# EAGLE design Dual VCA large - Rev3 (EAGLE 9.6.2)
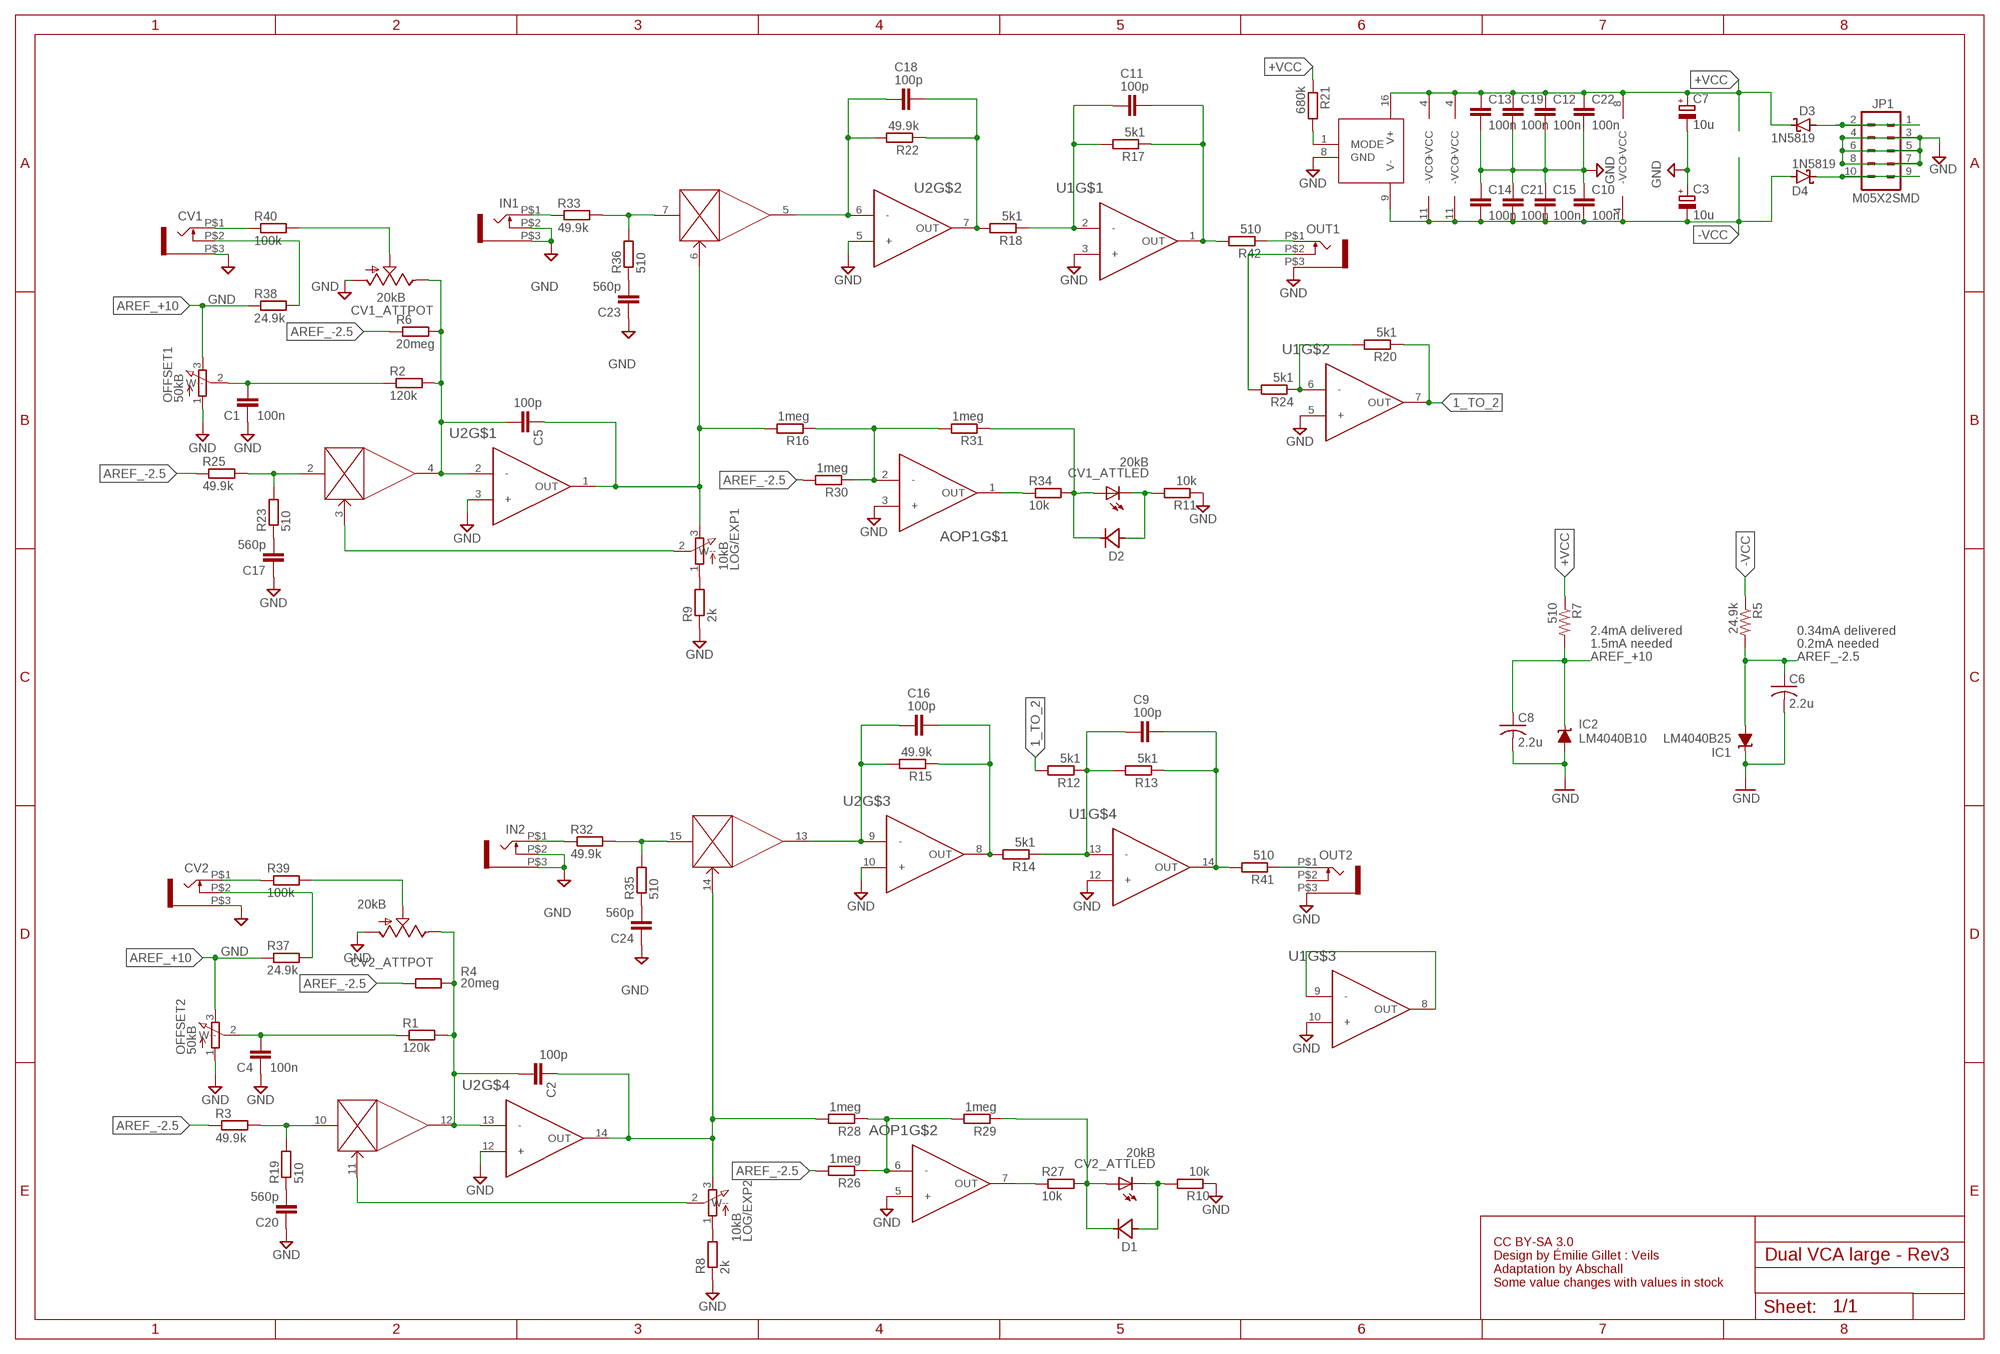
[diagram p0: schematic, sheet 1]

## Parts
AOP1  TL072ACDR  [SOIC8]
C1  100n  C-EUC0805K  [C0805K]
C2  100p  C-EUC0805K  [C0805K]
C3  10u  CPOL-EUB  [PANASONIC_B]
C4  100n  C-EUC0805K  [C0805K]
C5  100p  C-EUC0805K  [C0805K]
C6  2.2u  C-USC0805  [C0805]
C7  10u  CPOL-EUB  [PANASONIC_B]
C8  2.2u  C-USC0805  [C0805]
C9  100p  C-EUC0805K  [C0805K]
C10  100n  C-EUC0805K  [C0805K]
C11  100p  C-EUC0805K  [C0805K]
C12  100n  C-EUC0805K  [C0805K]
C13  100n  C-EUC0805K  [C0805K]
C14  100n  C-EUC0805K  [C0805K]
C15  100n  C-EUC0805K  [C0805K]
C16  100p  C-EUC0805K  [C0805K]
C17  560p  C-EUC0805K  [C0805K]
C18  100p  C-EUC0805K  [C0805K]
C19  100n  C-EUC0805K  [C0805K]
C20  560p  C-EUC0805K  [C0805K]
C21  100n  C-EUC0805K  [C0805K]
C22  100n  C-EUC0805K  [C0805K]
C23  560p  C-EUC0805K  [C0805K]
C24  560p  C-EUC0805K  [C0805K]
CV1  WQP-PJ301M-12_JACK  [WQP-PJ301M-12_JACK]
CV1_ATT  20kB  BOURNS_SLIDER  [BOURNS_SLIDER]
CV2  WQP-PJ301M-12_JACK  [WQP-PJ301M-12_JACK]
CV2_ATT  20kB  BOURNS_SLIDER  [BOURNS_SLIDER]
D1  1N4148WX  [SOD323-W]
D2  1N4148WX  [SOD323-W]
D3  1N5819  [SOD123]
D4  1N5819  [SOD123]
IC1  LM4040B25  LM4041B12DBZ  [DBZ_R-PDSO-G3]
IC2  LM4040B10  LM4041B12DBZ  [DBZ_R-PDSO-G3]
IN1  WQP-PJ301M-12_JACK  [WQP-PJ301M-12_JACK]
IN2  WQP-PJ301M-12_JACK  [WQP-PJ301M-12_JACK]
JP1  M05X2SMD  [2X5-SMD]
LOG/EXP1  10kB  ALPHA9MMSMALL_HOLE  [ALPHA9MM-SH]
LOG/EXP2  10kB  ALPHA9MMSMALL_HOLE  [ALPHA9MM-SH]
OFFSET1  50kB  ALPHA9MMSMALL_HOLE  [ALPHA9MM-SH]
OFFSET2  50kB  ALPHA9MMSMALL_HOLE  [ALPHA9MM-SH]
OUT1  WQP-PJ301M-12_JACK  [WQP-PJ301M-12_JACK]
OUT2  WQP-PJ301M-12_JACK  [WQP-PJ301M-12_JACK]
R1  120k  R-EU_R0805  [R0805]
R2  120k  R-EU_R0805  [R0805]
R3  49.9k  R-EU_R0805  [R0805]
R4  20meg  R-EU_R0805  [R0805]
R5  24.9k  R-US_R0805  [R0805]
R6  20meg  R-EU_R0805  [R0805]
R7  510  R-US_R0805  [R0805]
R8  2k  R-EU_R0805  [R0805]
R9  2k  R-EU_R0805  [R0805]
R10  10k  R-EU_R0805  [R0805]
R11  10k  R-EU_R0805  [R0805]
R12  5k1  R-EU_R0805  [R0805]
R13  5k1  R-EU_R0805  [R0805]
R14  5k1  R-EU_R0805  [R0805]
R15  49.9k  R-EU_R0805  [R0805]
R16  1meg  R-EU_R0805  [R0805]
R17  5k1  R-EU_R0805  [R0805]
R18  5k1  R-EU_R0805  [R0805]
R19  510  R-EU_R0805  [R0805]
R20  5k1  R-EU_R0805  [R0805]
R21  680k  R-EU_R0805  [R0805]
R22  49.9k  R-EU_R0805  [R0805]
R23  510  R-EU_R0805  [R0805]
R24  5k1  R-EU_R0805  [R0805]
R25  49.9k  R-EU_R0805  [R0805]
R26  1meg  R-EU_R0805  [R0805]
R27  10k  R-EU_R0805  [R0805]
R28  1meg  R-EU_R0805  [R0805]
R29  1meg  R-EU_R0805  [R0805]
R30  1meg  R-EU_R0805  [R0805]
R31  1meg  R-EU_R0805  [R0805]
R32  49.9k  R-EU_R0805  [R0805]
R33  49.9k  R-EU_R0805  [R0805]
R34  10k  R-EU_R0805  [R0805]
R35  510  R-EU_R0805  [R0805]
R36  510  R-EU_R0805  [R0805]
R37  24.9k  R-EU_R0805  [R0805]
R38  24.9k  R-EU_R0805  [R0805]
R39  100k  R-EU_R0805  [R0805]
R40  100k  R-EU_R0805  [R0805]
R41  510  R-EU_R0805  [R0805]
R42  510  R-EU_R0805  [R0805]
U1  TL74CD  [SO14]
U2  TL74CD  [SO14]
VCA1  V2164SOIC16N  [SOIC16N]

## Nets
1_TO_2: R12.2 R20.1 U1.7(OUT)
+VCC: AOP1.8(+VCC) C7.+ C12.1 C13.1 C19.1 C22.1 D3.C R7.1 R21.1 U1.4(+VCC) U2.4(+VCC) VCA1.16(V+)
-VCC: AOP1.4(-VCC) C3.- C10.2 C14.2 C15.2 C21.2 D4.A R5.1 U1.11(-VCC) U2.11(-VCC) VCA1.9(V-)
AREF_+10: C8.1 IC2.1(C) OFFSET1.3 OFFSET2.3 R7.2 R37.1 R38.1
AREF_-2.5: C6.1 IC1.2(A) R3.1 R4.1 R5.2 R6.1 R25.1 R26.2 R30.2
GND: AOP1.3(+) AOP1.5(+) C1.1 C3.+ C4.1 C6.2 C7.- C8.2 C10.1 C12.2 C13.2 C14.1 C15.1 C17.1 C19.2 C20.1 C21.1 C22.2 C23.1 C24.1 CV1.P$3 CV1_ATT.1(POT:A) CV2.P$3 CV2_ATT.1(POT:A) IC1.1(C) IC2.2(A) IN1.P$2 IN1.P$3 IN2.P$2 IN2.P$3 JP1.3 JP1.4 JP1.5 JP1.6 JP1.7 JP1.8 OFFSET1.1 OFFSET2.1 OUT1.P$3 OUT2.P$3 R8.1 R9.1 R10.1 R11.1 U1.3(+) U1.5(+) U1.10(+) U1.12(+) U2.3(+) U2.5(+) U2.10(+) U2.12(+) VCA1.8(GND)
N$1: C23.2 R36.1
N$2: CV2.P$1 R39.1
N$3: R33.2 R36.2 VCA1.7(IN)
N$4: C18.2 R22.2 U2.6(-) VCA1.5(OUT)
N$5: C5.2 CV1_ATT.3(POT:E) R2.2 R6.2 U2.2(-) VCA1.4(OUT)
N$6: IN2.P$1 R32.1
N$7: R21.2 VCA1.1(MODE)
N$8: C1.2 OFFSET1.2(W--) R2.1
N$9: C5.1 LOG/EXP1.3 R16.2 U2.1(OUT) VCA1.6(CV)
N$10: C17.2 R23.1
N$11: LOG/EXP1.1 R9.2
N$12: R23.2 R25.2 VCA1.2(IN)
N$13: LOG/EXP1.2(W--) VCA1.3(CV)
N$14: CV1_ATT.2(POT:S) R40.2
N$15: C11.2 R17.2 R18.1 U1.2(-)
N$16: R20.2 R24.1 U1.6(-)
N$17: CV1_ATT.E(LED:C) D2.A R11.2
N$18: CV2_ATT.B(LED:A) D1.C R27.2 R29.1
N$19: IN1.P$1 R33.1
N$20: CV1.P$2 R38.2
N$21: OUT1.P$1 R42.1
N$22: OUT1.P$2 R24.2
N$23: C24.2 R35.1
N$24: R32.2 R35.2 VCA1.15(IN)
N$25: C16.2 R15.2 U2.9(-) VCA1.13(OUT)
N$26: C2.1 LOG/EXP2.3 R28.2 U2.14(OUT) VCA1.14(CV)
N$27: C20.2 R19.1
N$28: R3.2 R19.2 VCA1.10(IN)
N$29: LOG/EXP2.1 R8.2
N$30: LOG/EXP2.2(W--) VCA1.11(CV)
N$31: C2.2 CV2_ATT.3(POT:E) R1.2 R4.2 U2.13(-) VCA1.12(OUT)
N$32: C4.2 OFFSET2.2(W--) R1.1
N$33: CV2_ATT.2(POT:S) R39.2
N$34: C9.2 R12.1 R13.2 R14.1 U1.13(-)
N$35: U1.8(OUT) U1.9(-)
N$37: CV1_ATT.B(LED:A) D2.C R31.1 R34.2
N$38: CV1.P$1 R40.1
N$40: CV2.P$2 R37.2
N$41: OUT2.P$1 R41.1
N$42: D4.C JP1.9 JP1.10
N$43: AOP1.1(OUT) R34.1
N$44: AOP1.2(-) R16.1 R30.1 R31.2
N$46: CV2_ATT.E(LED:C) D1.A R10.2
N$48: AOP1.7(OUT) R27.1
N$49: AOP1.6(-) R26.1 R28.1 R29.2
N$51: D3.A JP1.1 JP1.2
OUT: C18.1 R18.2 R22.1 U2.7(OUT)
OUT1: C11.1 R17.1 R42.2 U1.1(OUT)
OUT2: C16.1 R14.2 R15.1 U2.8(OUT)
OUT3: C9.1 R13.1 R41.2 U1.14(OUT)
Unconnected: OUT2.P$2

## Notes on the sheet
- 2.4mA delivered | 0.34mA delivered
- 1.5mA needed | 0.2mA needed
- CC BY-SA 3.0
  Design by Émilie Gillet : Veils 
  Adaptation by Abschall
  Some value changes with values in stock

## Library data of the parts
AOP1 = personal devices:TL072ACDR
C1 C2 C4 C5 C9-C24 = resistor:C-EU: CAPACITOR, European symbol
C3 C7 = rcl:CPOL-EU: POLARIZED CAPACITOR, European symbol; SPICEPREFIX: C
C6 C8 = rcl:C-US: CAPACITOR, American symbol
CV1 CV2 IN1 IN2 OUT1 OUT2 = thonkiconn:WQP-PJ301M-12_JACK
CV1_ATT CV2_ATT = og-pots:BOURNS_SLIDER
D1 D2 = personal devices:1N4148WX
D3 D4 = personal-ICs:1N5819
IC1 IC2 = texas:LM4041: PRECISION MICROPOWER SHUNT VOLTAGE REFERENCE Source: http://focus.ti.com/lit/ds/slcs146e/slcs146e.pdf
JP1 = og-header:M05X2: Header 5x2 Standard 10-pin dual row 0.1" header. Commonly used with AVR-ISP. Use with Spark Fun Electronics SKU: PRT-00778
LOG/EXP1 LOG/EXP2 OFFSET1 OFFSET2 = potentiometer:ALPHA9MM
R1-R4 R6 R8-R35 R37-R42 = resistor:R-EU_: RESISTOR, European symbol
R5 R7 = rcl:R-US_: RESISTOR, American symbol
R36 = rcl:R-EU_: RESISTOR, European symbol; SPICEPREFIX: R
U1 U2 = personal-ICs:TL74CD
VCA1 = personal-ICs:V2164

## Board
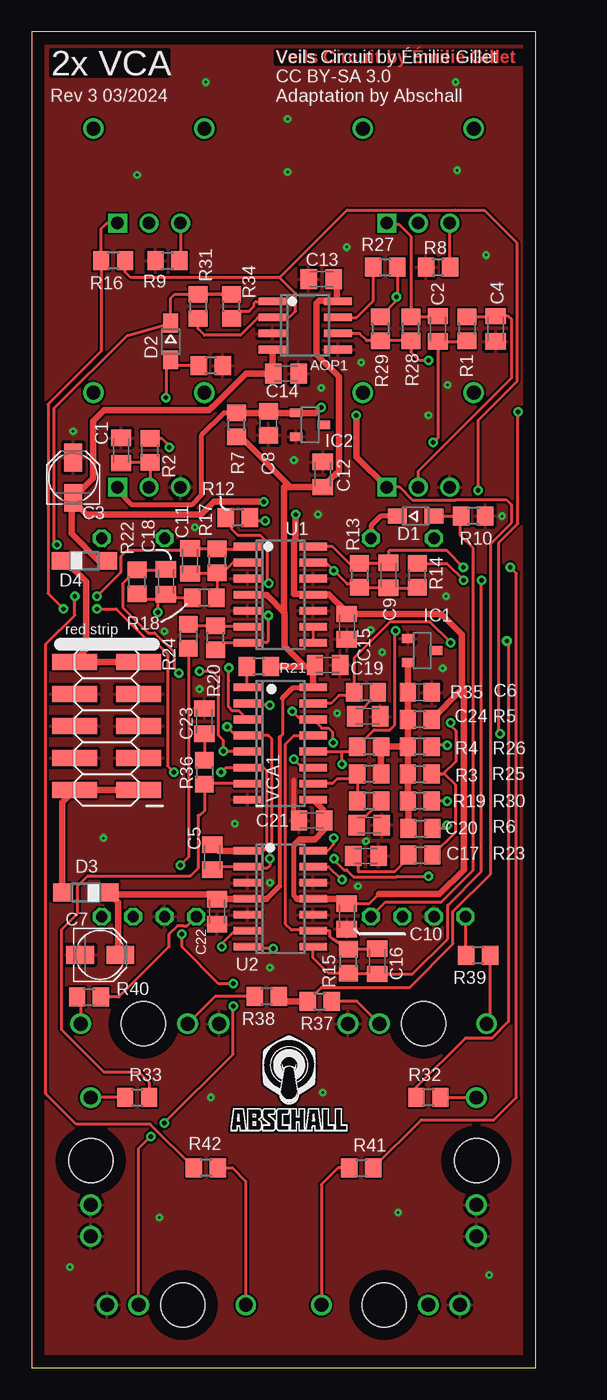
[diagram p1: board, top side]
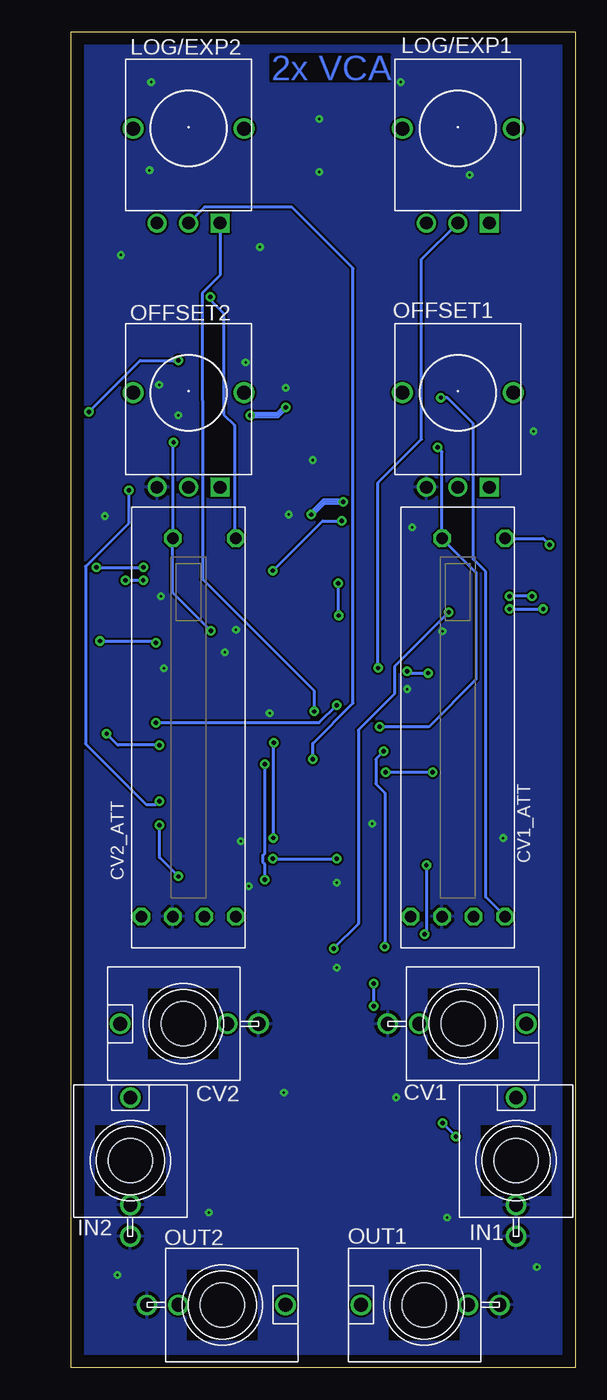
[diagram p2: board, bottom side, seen from below]

Size 40 x 106 mm. Coordinates in mm from the lower left corner, seen from the top.
Outline: 0,0 40,0 40,106 0,106 0,0
Copper layers (1*16): Top 0.035mm / dielectric 1.5mm / Bottom 0.035mm
Design rules "default": minimum track width 6mil, minimum drill 0.35mm, track to track 6mil, track to pad 6mil, pad to pad 6mil, via to via 6mil, smd to smd 6mil, copper to edge 40mil, drill to drill 6mil, minimum pad ring 10mil, minimum via ring 8mil, stop-mask expansion 4mil, vias tented up to drill 0mil, thermal gap 10mil

### Footprints (pad centres in the part's own frame; a part is rotated, then mirrored left to right if it is on the bottom)
SOIC8 = smd 0.6 x 2.2: 1 -1.905,-2.6; 2 -0.635,-2.6; 3 0.635,-2.6; 4 1.905,-2.6; 5 1.905,2.6; 6 0.635,2.6; 7 -0.635,2.6; 8 -1.905,2.6
C0805K = smd 1.3 x 1.6: 1 -1,0; 2 1,0
PANASONIC_B = smd 2.2 x 1.4: + 1.6,0; - -1.6,0
C0805 = smd 1.3 x 1.5: 1 -0.95,0; 2 0.95,0
WQP-PJ301M-12_JACK = drill 1.1: P$1 0,5; P$2 0,-3.5; P$3 0,-5.992 | hole 3.5: 0,0
BOURNS_SLIDER = drill 0.9 octagon: 1 -15,1.25; 2 -15,3.75; 3 15,1.25; B 15,-3.75; DUMMY -15,-1.25; E -15,-3.75
SOD323-W = smd 1.5 x 1.2: A 1.45,0; C -1.45,0
SOD123 = smd 1.4 x 1.4: A 1.9,0; C -1.9,0
DBZ_R-PDSO-G3 = smd 0.7 x 1: 1 -0.95,-1.1; 2 0.95,-1.1; 3 0,1.1
2X5-SMD = smd 3.556 x 1.27: 1 -2.54,5.08; 2 2.54,5.08; 3 -2.54,2.54; 4 2.54,2.54; 5 -2.54,0; 6 2.54,0; 7 -2.54,-2.54; 8 2.54,-2.54; 9 -2.54,-5.08; 10 2.54,-5.08
ALPHA9MM-SH = drill 1: 1 -2.5,0; 2 0,0 | drill 1 square: 3 2.5,0 | drill 1.1: NC1 -4.4,7.5; NC2 4.4,7.5
R0805 = smd 1.3 x 1.5: 1 -0.95,0; 2 0.95,0
SO14 = smd 0.6 x 2.2: 1 -3.81,-2.6; 2 -2.54,-2.6; 3 -1.27,-2.6; 4 0,-2.6; 5 1.27,-2.6; 6 2.54,-2.6; 7 3.81,-2.6; 8 3.81,2.6; 9 2.54,2.6; 10 1.27,2.6; 11 0,2.6; 12 -1.27,2.6; 13 -2.54,2.6; 14 -3.81,2.6
SOIC16N = smd 0.6 x 2.2: 1 -4.445,-2.6; 2 -3.175,-2.6; 3 -1.905,-2.6; 4 -0.635,-2.6; 5 0.635,-2.6; 6 1.905,-2.6; 7 3.175,-2.6; 8 4.445,-2.6; 9 4.445,2.6; 10 3.175,2.6; 11 1.905,2.6; 12 0.635,2.6; 13 -0.635,2.6; 14 -1.905,2.6; 15 -3.175,2.6; 16 -4.445,2.6

### Placement (x,y rotation side)
AOP1  21.72,82.68 270 top
C1  7.11,72.77 270 top
C2  32.26,82.42 270 top
C3  3.3,70.61 90 top
C4  36.83,82.42 90 top
C5  14.35,40.51 270 top
C6  30.81,53.59 0 top
C7  5.46,32.77 0 top
C8  18.8,74.93 270 top
C9  28.32,62.87 270 top
C10  25.02,35.81 90 top
C11  12.57,64.01 270 top
C12  23.11,70.87 90 top
C13  22.99,86.36 180 top
C14  20.19,78.87 180 top
C15  25.02,58.8 90 top
C16  27.43,32.26 90 top
C17  26.54,40.6 180 top
C18  10.67,62.36 90 top
C19  23.5,55.75 0 top
C20  26.8,43.05 180 top
C21  22.23,43.43 0 top
C22  14.73,36.2 270 top
C23  13.72,51.31 270 top
C24  26.67,51.69 180 top
CV1  8.89,27.3 270 bottom
CV1_ATT  9.32,50.8 90 bottom
CV2  31.11,27.3 90 bottom
CV2_ATT  30.69,50.8 90 bottom
D1  30.48,67.56 0 top
D2  11.05,81.41 270 top
D3  4.32,37.72 180 top
D4  4.19,64.01 0 top
IC1  30.99,56.9 270 top
IC2  22.1,74.8 270 top
IN1  4.7,16.45 0 bottom
IN2  35.31,16.45 0 bottom
JP1  5.97,50.93 180 top
LOG/EXP1  9.32,90.81 0 bottom
LOG/EXP2  30.69,90.81 0 bottom
OFFSET1  9.32,69.85 0 bottom
OFFSET2  30.69,69.85 0 bottom
OUT1  12,5 90 bottom
OUT2  28,5 270 bottom
R1  34.54,82.42 270 top
R2  9.4,72.77 90 top
R3  26.8,47.12 180 top
R4  26.8,49.28 180 top
R5  30.81,51.44 180 top
R6  30.86,42.8 0 top
R7  16.26,74.8 90 top
R8  32.26,87.31 0 top
R9  10.79,87.82 0 top
R10  35.05,67.56 180 top
R11  14.22,79.5 180 top
R12  16.38,67.44 180 top
R13  26.04,62.87 270 top
R14  30.61,62.87 90 top
R15  25.15,32.26 90 top
R16  6.48,87.82 180 top
R17  14.73,64.01 270 top
R18  13.72,61.09 180 top
R19  26.8,44.96 180 top
R20  14.61,57.91 90 top
R21  18.03,55.63 180 top
R22  8.38,62.36 90 top
R23  30.86,40.68 0 top
R24  12.45,58.04 270 top
R25  30.81,47.12 0 top
R26  30.81,49.28 180 top
R27  28.07,87.31 0 top
R28  30.1,82.42 90 top
R29  27.69,82.42 270 top
R30  30.81,44.96 180 top
R31  13.21,84.2 270 top
R32  31.5,21.46 180 top
R33  8.38,21.46 0 top
R34  15.88,84.2 90 top
R35  26.54,53.59 180 top
R36  13.72,47.24 270 top
R37  22.86,29.08 0 top
R38  18.67,29.46 180 top
R39  35.43,32.73 180 top
R40  4.57,29.42 0 top
R41  26.16,15.88 0 top
R42  13.84,15.88 180 top
U1  19.75,61.34 270 top
U2  19.75,37.21 270 top
VCA1  19.75,49.53 270 top

### Tracks (layer width: path | path; a pad name or v marks a point on that pad's centre or on a via)
1_TO_2  (via drill 0.35)
  Top 0.254: R20.1 15.17,57.53 U1.7 18.67,57.53 18.79,57.65 v18.79,59.68 | R12.2 15.88,67.44 15.88,66.55 16.38,66.04 18.16,66.04 18.69,65.51 18.69,62.38 v18.82,62.25
  Bottom 0.254: v18.79,59.68 18.82,59.71 v18.82,62.25
+VCC
  Top 0.254: 19.9,53.12 19.9,50.26 19.68,50.04
  Top 0.305: 19.68,50.04 19.68,38.23
  Top 0.406: 22.29,53.92 20.7,53.92 19.9,53.12 | 19.68,38.23 18.67,37.21
  Top 0.508: C7.+ 6.86,32.97 6.86,36.94 6.22,37.58 6.36,37.58 | U1.4 17.2,61.28 18.67,61.28 20.05,59.91 | 20.05,59.91 20.07,59.89 20.07,57.28 21.72,55.63 | 21.72,55.63 22.37,55.63 C19.1 22.35,55.61 VCA1.16 22.29,53.92 | R7.1 16.57,73.85 20.56,69.87 | 20.56,69.87 C12.1 24.06,70.81 24.08,70.81 24.38,71.11 24.38,78.61 22.61,80.39 22.61,84.45 22.81,84.66 24.24,84.66 | 20.56,69.87 20.05,69.87 20.05,59.91 | C13.1 24.24,86.11 24.24,84.66 | 24.24,84.66 AOP1.8 | 21.72,55.63 R21.1 | 18.67,37.21 U2.4 14.75,37.21 C22.1 14.35,37.58 7.11,37.58 6.36,37.58 | D3.C 6.36,37.58
-VCC  (via drill 0.35)
  Top 0.254: 25.27,37.21 25.27,37.07 C10.2 25.04,36.83 26.8,36.83 27.56,37.59
  Top 0.406: 21.08,37.21 20.83,37.47 20.83,41.48
  Top 0.508: 3.17,68.89 3.17,66.17 5.33,64.01 D4.A | 3.17,68.89 C3.- 4.89,70.6 4.89,75.1 5.78,75.99 14.1,75.99 14.31,76.2 14.35,76.2 17.02,78.87 C14.2 19.12,78.94 AOP1.4 | 21.08,37.21 U2.11 25.27,37.21 | R5.1 34.16,53.83 | 34.16,53.83 34.29,53.96 34.29,39.5 32.38,37.59 27.56,37.59 | 34.16,53.83 34.16,58.17 32.53,59.8 C15.2 25.02,59.94 23.62,61.34 U1.11 22.29,61.4 20.84,61.4 20.84,65.62 20.95,65.73 v20.95,67.69 | v18.41,68.71 14.47,68.71 13.44,67.67 4.39,67.67 3.17,68.89 | 20.83,41.48 21.26,41.91 22.48,41.91 23.23,42.66 C21.2 23.12,43.43 23.12,44.31 VCA1.9
  Bottom 0.508: v20.95,67.69 19.94,68.71 v18.41,68.71
AREF_+10  (via drill 0.35)
  Top 0.254: C8.1 18.67,75.75 | R37.1 23.03,30.2 30.01,30.2 33.45,33.64 33.45,36.21 36.45,39.2 36.45,65.41 38.1,67.06 38.1,68.45 37.72,68.83 33.63,68.83 33.62,68.82 30.26,68.82 29.23,69.85 OFFSET2.3
  Top 0.406: R7.2 15.27,75.75 13.46,73.94 13.46,69.22 12.7,68.45 8,68.45 6.82,69.64 OFFSET1.3 | C8.1 18.73,75.82 18.73,75.75
  Top 0.508: R37.1 20,29.08 R38.1 | R7.2 18.67,75.75 | 18.73,75.75 IC2.1 22.54,75.75 v22.99,76.2 | OFFSET2.3 25.78,72.26 v25.78,75.56
  Bottom 0.508: v25.78,75.56 23.62,75.56 v22.99,76.2
AREF_-2.5
  Top 0.508: R6.1 29.91,44.91 R30.2 R25.1 R26.2 | R26.2 R5.2 C6.1 29.86,55.92 IC1.2 | R26.2 R4.1 R3.1
GND  (via drill 0.2)
  Top 0.406: C21.1 20.83,43.83 20.83,46.61
  other vias: 5.71,42.04 20.32,99.06 33.66,101.98 13.84,101.98 31.5,75.56 13.34,53.85 26.54,41.78 16.13,43.18 10.54,58.42 18.92,31.75 18.92,38.48 20.83,72.01 25.02,88.9 36.07,88.27 27.81,56.77 12.95,66.67 3.3,74.3 26.92,58.55 32.89,61.21 37.34,67.56 33.02,77.98 22.99,77.72 26.16,79.76 22.73,67.69 23.11,21.84 14.22,21.46 36.32,7.37 29.08,12.32 3.05,8 10.16,11.94 20.32,94.87 33.78,95 8.38,94.61 32.64,55.5 24.26,51.94 25.91,38.23
  pour Bottom: 0,105.92 0,0.25 39.75,0.25 39.88,0.13 39.88,105.92
  pour Top: 0,106.05 0,0 40.01,0 40.01,106.05
N$1
  Top 0.254: C23.2 R36.1
N$2
  Top 0.254: R39.1 36.38,27.57 CV2.P$1
N$3
  Top 0.254: R33.2 9.33,22.67 8.51,23.5 5.71,23.5 2.41,26.8 2.41,34.8 3.67,36.06 3.67,38.24 4.46,39.03 12.62,39.03 13.21,39.62 13.21,43.81 13.34,43.81 13.72,44.2 R36.2 13.72,46.35 VCA1.7
N$4  (via drill 0.35)
  Top 0.254: v13.34,55.24 14.35,55.24 14.86,54.74 14.86,50.16 15.22,49.81 v15.22,48.91 17.13,48.91 VCA1.5 | v11.68,55.12 11.3,55.5 11.3,56.77 9.78,58.29 9.27,58.29 7.24,60.33 7.24,62.23 8.32,63.31 R22.2 10.62,63.31 C18.2 | U2.6 16.13,34.67 15.11,33.66 v15.11,33.4
  Bottom 0.254: v13.34,55.24 13.21,55.12 v11.68,55.12 | v15.11,33.4 15.09,33.42 15.09,45.59 15.83,46.33 15.83,48.3 v15.22,48.91
N$5  (via drill 0.35)
  Top 0.254: v10.92,73.03 10.92,73.15 10.35,73.72 R2.2 | C5.2 14.59,39.75 U2.2 17.28,39.62 18.67,39.62 18.92,39.88 v18.92,40.39 18.92,40.95 19.07,41.11 19.07,49.89 18.8,50.16 VCA1.4 16.21,50.16 v15.52,50.86 | v31.5,38.99 29.02,38.99 29,38.96 25.55,38.96 25,39.52 24.78,39.52 24,40.29 v24,40.39 | v33,43.05 32.74,42.8 R6.2
  Bottom 0.254: v10.92,73.03 10.57,72.67 CV1_ATT.3 7.87,63.11 7.87,54.61 11.63,50.86 v15.52,50.86 | v24,40.39 v18.92,40.39 | v31.5,38.99 33,40.49 v33,43.05
N$6
  Top 0.254: R32.1 35.29,21.46 IN2.P$1
N$7
  Top 0.254: VCA1.1 17.08,54.04 R21.2
N$8
  Top 0.254: OFFSET1.2 9.4,69.93 R2.1 7.16,71.82 C1.2
N$9  (via drill 0.35)
  Top 0.254: 16.76,41.02 18.41,41.02 18.67,41.27 18.67,47.37 18.41,47.62 VCA1.6 15.42,47.62 v15.04,47.24 | LOG/EXP1.3 5.97,90.81 5.53,90.36 R16.2 5.53,80.65 1.31,76.44 1.31,61.43 v2.54,60.2 | v5.21,60.2 6.73,60.2 9.14,57.78 9.65,57.78 10.79,56.64 10.79,47.75 v11.3,47.24
  Top 0.508: U2.1 16.76,41.02 14.84,41.02 C5.1
  Bottom 0.254: v5.21,60.2 v2.54,60.2 | v11.3,47.24 v15.04,47.24
N$10
  Top 0.254: C17.2 25.91,40.23 25.91,39.37 28.83,39.37 29.91,40.45 R23.1
N$11
  Top 0.254: LOG/EXP1.1 11.82,87.89 R9.2
N$12  (via drill 0.35)
  Top 0.254: R23.2 33.66,42.52 33.66,46.23 32.77,47.12 R25.2 32.65,47.12 33.66,48.12 33.66,50.55 33.27,50.93 v33.27,51.18 | v18.92,52.58 17.28,52.58 VCA1.2
  Bottom 0.254: v33.27,51.18 20.32,51.18 v18.92,52.58
N$13  (via drill 0.35)
  Top 0.254: VCA1.3 16.46,52.13 15.93,52.13 15.65,52.41 15.65,54.52 15.64,54.53 v15.64,55.52
  Bottom 0.254: v15.64,55.52 15.64,70.21 12.19,73.66 12.19,87.93 LOG/EXP1.2
N$14
  Top 0.254: R40.2 6.92,29.42 10.92,33.43 10.92,34.42 11.58,35.08 12.06,35.08 12.34,35.08 CV1_ATT.2
N$15
  Top 0.254: U1.2 16,63.88 15.18,63.06 R17.2 | C11.2 12.62,63.06 R17.2 | R17.2 14.73,61.15 R18.1
N$16
  Top 0.254: R24.1 12.54,58.9 12.57,58.86 R20.2 17.09,58.86 U1.6
N$17  (via drill 0.35)
  Top 0.254: D2.A 10.88,79.79 | 10.88,79.79 10.67,79.58 v10.67,76.96 | R11.2 11.18,79.5 10.88,79.79
  Bottom 0.254: CV1_ATT.E 7.11,37.34 7.11,63.16 8.11,64.15 8.11,74.91 10.16,76.96 v10.67,76.96
N$18  (via drill 0.35)
  Top 0.254: R27.2 29.02,85.02 v28.96,84.96 28.96,84.64 R29.1
  Top 0.406: D1.C 27.69,67.56 26.94,66.81 CV2_ATT.B
  Bottom 0.254: v28.96,84.96 28.96,84.71 27.9,83.65 27.9,75.62 27.05,74.77 27.05,65.91 CV2_ATT.B
N$19
  Top 0.254: R33.1 4.71,21.46 IN1.P$1
N$20
  Top 0.254: R38.2 14.55,29.46 CV1.P$2
N$21
  Top 0.254: R42.1 15.94,15.88 17,14.81 OUT1.P$1
N$22  (via drill 0.35)
  Top 0.254: OUT1.P$2 8.5,17.41 9.46,18.36 v9.47,18.36 | v16,30.48 14.86,30.48 11.94,33.4 v11.94,34.42 | R24.2 12.45,40.51 v11.81,39.88 | v10.54,19.43 16,24.89 v16,28.7
  Bottom 0.254: v16,30.48 v16,28.7 | v11.81,39.88 v11.8,39.88 11.8,34.55 v11.94,34.42 | v9.47,18.36 v10.54,19.43
N$23
  Top 0.254: R35.1 27.38,53.48 27.47,53.48 C24.2
N$24  (via drill 0.35)
  Top 0.254: VCA1.15 23.75,52.7 24.38,53.34 25.34,53.34 R35.2 25.59,56.33 28.45,59.18 31.62,59.18 v33.27,57.53 | R32.2 30.55,22.29 34.46,26.2 36.57,26.2 37.85,27.47 37.85,57.53 v37.72,57.66
  Bottom 0.254: v37.72,57.66 33.4,57.66 v33.27,57.53
N$25
  Top 0.254: C16.2 27.38,33.21 R15.2 23.88,34.04 23.68,34.23 23.68,34.67 U2.9 22.29,34.73 20.62,34.73 20.17,35.18 20.17,49.51 20.83,50.16 VCA1.13
N$26  (via drill 0.35)
  Top 0.254: C2.1 32.21,83.37 R28.2 30.1,89.78 29.2,90.68 28.31,90.68 LOG/EXP2.3 | v23.93,49.6 23.93,49.73 23.88,49.78 23.88,50.43 23.56,50.74 23.04,50.74 VCA1.14 21.34,51.44 v20.7,52.07 | v23.98,42.04 23.98,41.53 23.47,41.02 U2.14
  Bottom 0.254: v23.93,49.6 23.98,49.55 v23.98,42.04 | LOG/EXP2.3 28.19,86.66 29.61,85.23 29.61,76.76 29.59,76.74 29.59,62.57 20.7,53.68 v20.7,52.07
N$27
  Top 0.254: C20.2 27.67,44.88 R19.1
N$28
  Top 0.254: VCA1.10 23.88,46.35 24.26,46.74 25.47,46.74 R3.2 R19.2
N$29
  Top 0.254: R8.2 33.21,90.78 LOG/EXP2.1
N$30  (via drill 0.35)
  Top 0.254: VCA1.11 21.47,47.62 v20.82,48.27
  Bottom 0.254: v20.82,48.27 20.82,49.53 17.63,52.73 17.63,87.23 22.48,92.08 29.42,92.08 LOG/EXP2.2
N$31  (via drill 0.35)
  Top 0.254: VCA1.12 24.64,48.9 | 24.64,48.9 25.47,48.9 R4.2 27.18,50.61 28.44,50.61 28.83,51 28.83,58.39 v28.91,58.47 | U2.13 23.58,39.75 24.6,38.73 v24.64,38.73 | v24.64,47.88 24.64,48.9 | R1.2 34.49,81.42 C2.2 32.26,73.79 v31.88,73.41
  Bottom 0.254: v24.64,38.73 24.64,39.96 24.79,40.11 24.79,40.66 24.64,40.81 v24.64,47.88 | v28.91,58.47 31.94,61.5 CV2_ATT.3 31.94,73.35 v31.88,73.41
N$32
  Top 0.254: R1.1 36.78,83.37 C4.2 37.85,83.42 38.1,83.17 38.1,78.53 30.69,71.12 OFFSET2.2
N$33
  Top 0.254: R39.2 34.48,35.75 CV2_ATT.2
N$34  (via drill 0.35)
  Top 0.254: U1.13 23.36,63.88 v23.99,63.25 25.07,62.17 25.27,62.17 25.53,61.91 R13.2 28.27,61.91 C9.2 30.56,61.87 R14.1 | v18.54,67.18 17.91,67.18 17.65,67.44 R12.1
  Bottom 0.254: v23.99,63.25 20.05,67.18 v18.54,67.18
N$35
  Top 0.254: U1.9 U1.8
N$37  (via drill 0.35)
  Top 0.254: v2.03,65.28 1.78,65.53 1.78,76.07 7.6,81.89 D2.C 11.05,84.84 11.36,85.15 R34.2 R31.1
  Bottom 0.254: CV1_ATT.B 2.55,65.8 v2.03,65.28
N$38
  Top 0.254: R40.1 3.89,29.16 CV1.P$1
N$40
  Top 0.254: CV2.P$2 25.84,29.08 R37.2
N$41
  Top 0.254: R41.1 24.32,15.88 23,14.55 OUT2.P$1
N$42
  Top 0.508: JP1.9 JP1.10 3.43,56.13 4.32,57.03 4.32,62.36 2.67,64.01 D4.C
N$43
  Top 0.254: R34.1 16.44,83.82 17.27,83.82 17.65,84.2 17.65,84.45 17.78,84.58 AOP1.1
N$44  (via drill 0.35)
  Top 0.254: R16.1 7.43,86.93 7.87,86.49 19.68,86.49 | 19.68,86.49 20.95,85.22 20.95,83.82 20.45,83.31 AOP1.2 17.97,83.31 16.58,81.92 13.72,81.92 13.21,82.42 R31.2 | 19.68,86.49 25.04,91.84 33.62,91.84 33.63,91.82 35.94,91.82 38.51,89.26 38.51,78.23 35.43,75.16 v35.43,69.6 | v33,44.96 R30.1
  Bottom 0.254: v35.43,69.6 35.43,66.99 38.86,63.57 38.86,49.51 34.05,44.7 33.25,44.7 v33,44.96
N$46
  Top 0.254: D1.A 34.04,67.56 | 34.04,67.56 R10.2 | CV2_ATT.E 28.09,36.96 32.51,36.96 35.05,39.5 35.05,65.02 34.04,66.04 34.04,67.56
N$48
  Top 0.254: AOP1.7 25.78,83.31 27.12,84.65 R27.1
N$49  (via drill 0.35)
  Top 0.254: AOP1.6 26.04,82.04 26.6,81.47 R29.2 R28.1 30.1,80.58 30.78,79.91 v31.5,79.91 | v33,49.4 31.89,49.4 R26.1 | v37.19,50.29 37.06,50.42 37.06,65.44 38.61,66.99 v38.61,75.82
  Bottom 0.254: v37.19,50.29 36.3,49.4 v33,49.4 | v38.61,75.82 34.52,79.91 v31.5,79.91
N$51
  Top 0.508: JP1.1 JP1.2 2.98,45.4 2.54,44.96 2.42,44.84 D3.A | JP1.1 8.76,45.85 9.02,45.59 8.76,45.59 JP1.1
OUT  (via drill 0.35)
  Top 0.254: R18.2 11.18,61.09 11.05,60.96 10.41,60.96 | 10.41,60.96 10.16,60.96 | 10.16,60.96 8.76,60.96 8.38,61.34 R22.1 | 10.41,60.96 10.67,61.21 C18.1 | v19.18,33.27 17.28,33.27 U2.7 | 10.16,60.96 10.03,60.83 v10.03,59.94
  Bottom 0.254: v19.18,33.27 17.23,35.23 17.23,50.59 14.35,53.47 14.35,55.63 v10.03,59.94
OUT1  (via drill 0.35)
  Top 0.254: U1.1 16.96,64.96 R17.1 14.68,65.01 C11.1 12.38,64.82 7.54,64.82 7.11,64.39 7.11,63.12 v5.21,61.21 | R42.2 9.43,19.34 3.56,19.34 1.14,21.75 1.14,57.4 3.43,59.69 v3.43,61.21
  Bottom 0.254: v3.43,61.21 v5.21,61.21
OUT2  (via drill 0.35)
  Top 0.254: U2.8 22.35,32.52 23.56,31.31 R15.1 27.38,31.31 C16.1 30.24,31.26 33.02,34.04 33.02,36.7 35.69,39.37 35.69,62.48 v35.71,62.48 | R14.2 32.96,63.81 v34.29,62.48
  Bottom 0.254: v35.71,62.48 v34.29,62.48
OUT3  (via drill 0.35)
  Top 0.254: U1.14 23.88,65.15 25.21,63.81 R13.1 28.27,63.81 C9.1 28.32,64.77 28.37,64.82 32.95,64.82 v34.27,63.5 | R41.2 30.92,19.68 36.7,19.68 38.48,21.46 38.48,63.02 v38,63.5
  Bottom 0.254: v38,63.5 v34.27,63.5
(copper drawn outside any net)
  shapes: Top area x17168

### Text on the board
Top: 2x VCA | Veils Circuit by Émilie Gillet | D:/Images/Inkspace/Upschall/Abschall Vertical Logo Simple.bmp
Bottom: 2x VCA
tPlace: D:/Images/Inkspace/Upschall/Abschall Vertical Logo Simple.bmp
tNames: 2x VCA | Veils Circuit by Émilie Gillet | Rev 3 03/2024 | CC BY-SA 3.0 / Adaptation by Abschall | red strip